# Altium project MMS Tester.PrjPcb
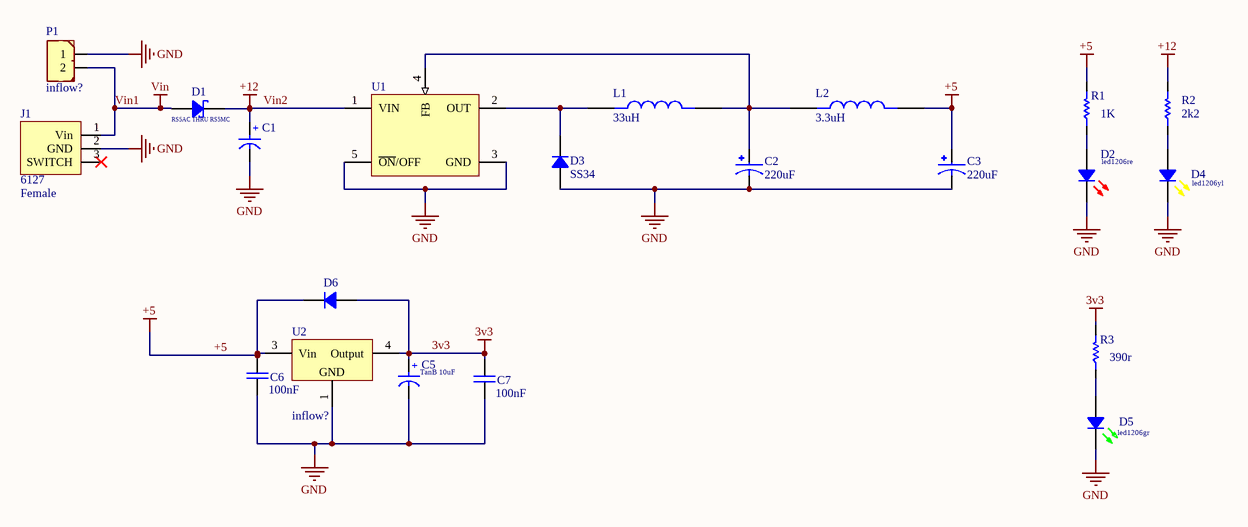
[diagram p0: voltage regulators.SchDoc]
By: A.SharifNia; Email: arsham.sharifnia@gmail.com
2 sheets, 60 parts. Net scope: flat (ports and power ports of the same name join across sheets).
Board file: FinalPCB.PcbDoc
Sheets:
  voltage regulators.SchDoc
  Transistors.SchDoc

## Sheet voltage regulators.SchDoc
size A; SheetNumber: 1; SheetTotal: 2

### Parts
C1  1000u'F, 25'V  [Cap electrolitic radial 10x20-5]  (value not drawn)
C2  220uF  [PCBComponent_1]
C3  220uF  [PCBComponent_1]
C5  TanB 10uF  [SMT_C_Tantalum_B]
C6  100nF  [CAP 1206/3216]
C7  100nF  [CAP 1206/3216]
D1  RS5AC THRU RS5MC  [DO-214AB(SMC)]
D2  led1206re  [LED 1206/3216 RED]
D3  SS34  [SS34]
D4  led1206yl  [LED 1206/3216 YELLOW]
D5  led1206gr  [LED 1206/3216 GREEN]
D6  1N4148  [LL4148]  (value not drawn)
J1  Inflow: 6127  [Power Jack BIG]  (hidden comment: Female)
L1  33uH  [Ind7.3x6.6]
L2  3.3uH  [IND5.3x5.3]
P1  Inflow: inflow?  [Phoenix_2PIN_RA_P5.08mm]  (hidden comment: 2'Pin)
R1  1K  [RES 1206 (3216X08L)]
R2  2k2  [RES 1206 (3216X08L)]
R3  390r  [RES 1206 (3216X08L)]
U1  lm2596-5vCTE  [D2PAK_TO-263-5]  (value not drawn)
U2  Inflow: inflow?  [TO252-3N]  (hidden comment: AMS1117CD)

### Nets
3v3: C5.1(+) C7.1 D6.1 R3.2 U2.4(Output)
+5: C3.1 C6.1 D6.2 L2.2 R1.2 U2.3(Vin)
GND: C1.2(-) C2.2 C3.2 C5.2(-) C6.2 C7.2 D2.2 D3.1 D4.2 D5.2 J1.2(GND) P1.1 U1.3(GND) U1.5(~{ON}/OFF) U2.1(GND)
Vin1: D1.1 J1.1(Vin) P1.2  [also labelled Vin]
Vin2: C1.1(+) D1.2 R2.2 U1.1(VIN)  [also labelled +12]
NetC2_1: C2.1 L1.2 L2.1 U1.4(FB)
NetD2_1: D2.1 R1.1
NetD3_2: D3.2 L1.1 U1.2(OUT)
NetD4_1: D4.1 R2.1
NetD5_1: D5.1 R3.1

Not connected (* = marked no-connect by the designer): J1 3(SWITCH)*

### Library data of the parts
C1 = Cap_Elec_1000u_25: Electrolit Capacitor; Inflow: 4225; Rating: Rating?; Type: Type?; Validation: NT; Value: 1000u'F, 25'V; Package: Package?
C2 C3 = Cap_SMD7x7
C5 = Cap_Tantalum: Tantalum Capacitor,TAJ Series-SMD; Inflow: inflow?; Validation: Valid; Rating: Rating?; Value: Value?; Package: Package?; Type: Tantalum
C6 C7 = Cap_Multi_22p_50_1206: Bipolar ceramic capacitor SMD; Value: 22p'F, 50'V; Rating: Rating?; Type: Type?; Validation: Valid; Inflow: 5240; Package: Package?
D1 = Semi_Diod_Sch_SK54: Surface Mount Fast Recovery Rectifiers / Reverse Voltage - 50 to 1000 V / Forward Current - 5 A; Type: Schottky; Rating: Rating?; Value: SK54; Validation: Valid; Inflow: 5230; Package: SMC
D2 = Semi_LED_Red_1206: LED; Inflow: 5253; Rating: Rating?; Type: Type?; Validation: Valid; Value: Red, 1206; Package: Package?
D3 = SS34: Schottky Rectifiers; Rating: Rating?; Value: SK54; Validation: Valid; Type: Schottky; Package: SMC; Arsham: SS34
D4 = Semi_LED_Yellow_1206: LED; Rating: Rating?; Type: Type?; Validation: Valid; Inflow: 5250; Value: Yellow, 1206; Package: Package?
D5 = Semi_LED_Green_1206: LED; Rating: Rating?; Type: Type?; Validation: Valid; Inflow: 5247; Value: Green, 1206; Package: Package?
D6 = Semi_Diod_STD_1N4148_MELF: High Conductance Fast Diode; Rating: Rating?; Type: Type?; Validation: NT; Inflow: 6205; Value: 1N4148; Package: Package?
J1 = Con_Power_Jack: Power Jack; Rating: Rating?; Validation: Valid; Type: Type?; Package: Package?; Value: Female
L1 = IND 7.3x7.3: Isat=2.5A / (ohm)max. 240 m-Ohm  @ 100kHz
L2 = IND 5.3x5.3: Isat=1.74A / (ohm)max. .0.037 @ 100kHz
P1 = Con_Power_2: Power Connector 2'Pin; Rating: Rating?; Validation: NT; Value: 2'Pin; Package: Package?; Type: Type?
R1 R3 = Res_SMD_1206: Resistor; Inflow: inflow?; Rating: 0.25W; Validation: Valid; Value: Value?; Package: 1206; Type: 10%
R2 = Res_SMD: Resistor; Inflow: inflow?; Rating: Rating?; Validation: Valid; Value: Value?; Package: Package?; Type: 10%
U1 = IC_Reg_LM2596: Simple switcher 3'A step-down voltage regulator; Value: Value?; Rating: S; Validation: Valid; Inflow: inflow?; Type: Switching; Package: TO-263
U2 = IC_Reg_AMS1117_CD: 800mA LOW DROPOUT VOLTAGE REGULATOR; Rating: Rating?; Validation: NT; Value: AMS1117CD; Package: Package?; Type: Type?

## Sheet Transistors.SchDoc
size A; SheetNumber: 2; SheetTotal: 2
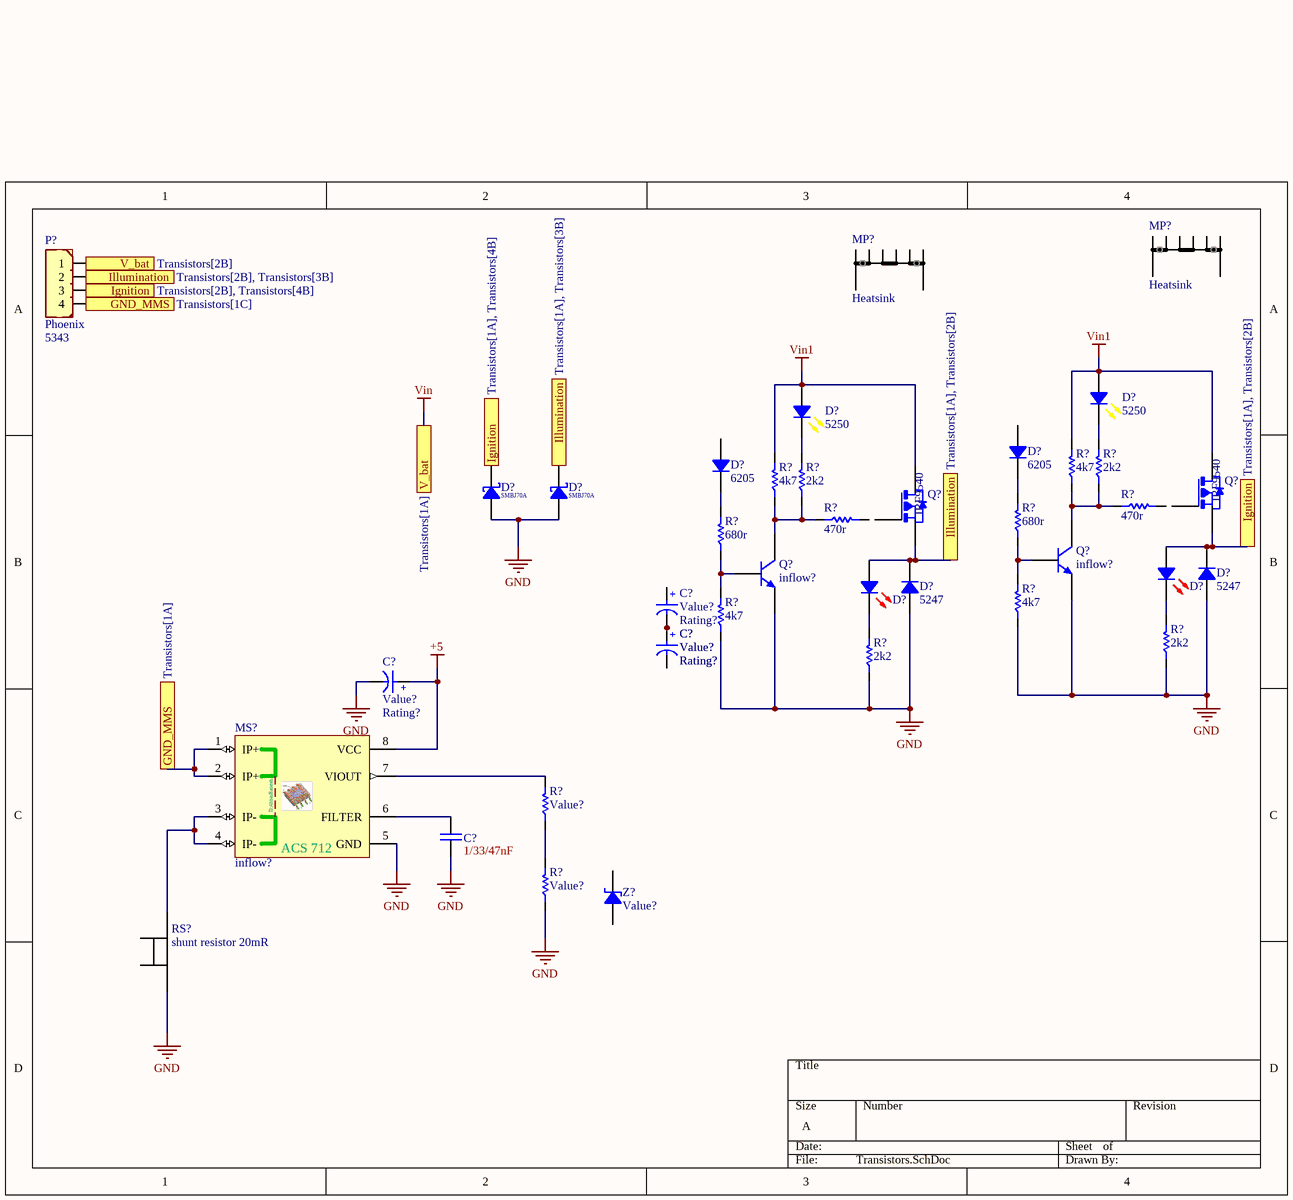
[diagram p1: Transistors.SchDoc]

### Parts
(Parts that share a designator on the sheet are numbered #1, #2 ... from top to bottom, then left to right.)
C?#1  Rating: Rating?  [SMT_C_Tantalum_A]  (hidden comment: Value?)
C?#2  Rating: Rating?  [SMT_C_Tantalum_A]  (hidden comment: Value?)
C?#3  Rating: Rating?  [SMT_C_Tantalum_A]  (hidden comment: Value?)
C?#4  Rating: Rating?  [SMT_C_Tantalum_A]  (hidden comment: Value?)
C?#5  1/33/47nF  [CAP 1206/3216]
D?#1  Inflow: 5250  [LED 1206/3216 YELLOW]  (hidden comment: Yellow, 1206)
D?#2  Inflow: 5250  [LED 1206/3216 YELLOW]  (hidden comment: Yellow, 1206)
D?#3  Inflow: 6205  [LL4148]  (hidden comment: 1N4148)
D?#4  Inflow: 6205  [LL4148]  (hidden comment: 1N4148)
D?#5  SMBJ70A  [DO214AA SMB]
D?#6  SMBJ70A  [DO214AA SMB]
D?#7  Red, 1206  [LED 1206/3216 RED]  (value not drawn)
D?#8  Red, 1206  [LED 1206/3216 RED]  (value not drawn)
D?#9  Inflow: 5247  [DO214AC SMA]  (hidden comment: 1N4007)
D?#10  Inflow: 5247  [DO214AC SMA]  (hidden comment: 1N4007)
MP?#1  Heatsink  [Heatsink]
MP?#2  Heatsink  [Heatsink]
MS?  Inflow: inflow?  [8S2_N]  (hidden comment: ACS712-5A)
P?  Inflow: 5343  [Phoenix_4PIN_RA_P5.08mm]  (hidden comment: Phoenix)
Q?#1  Inflow: IRF9540  [TO-220AB]  (hidden comment: IRF9Z24)
Q?#2  Inflow: IRF9540  [TO-220AB]  (hidden comment: IRF9Z24)
Q?#3  Inflow: inflow?  [SOT23_N]  (hidden comment: NPN)
Q?#4  Inflow: inflow?  [SOT23_N]  (hidden comment: NPN)
R?#1  4k7  [RES 1206 (3216X08L)]
R?#2  2k2  [RES 1206 (3216X08L)]
R?#3  4k7  [RES 1206 (3216X08L)]
R?#4  2k2  [RES 1206 (3216X08L)]
R?#5  470r  [RES 1206 (3216X08L)]
R?#6  470r  [RES 1206 (3216X08L)]
R?#7  680r  [RES 1206 (3216X08L)]
R?#8  680r  [RES 1206 (3216X08L)]
R?#9  4k7  [RES 1206 (3216X08L)]
R?#10  4k7  [RES 1206 (3216X08L)]
R?#11  2k2  [RES 1206 (3216X08L)]
R?#12  2k2  [RES 1206 (3216X08L)]
R?#13  Value?  [RES 1206 (3216X08L)]
R?#14  Value?  [RES 1206 (3216X08L)]
RS?  shunt resistor 20mR  [shunt resistor]
Z?  Value?  [SOD80, LL-34]

### Ports
GND_MMS (see Transistors[1A]), GND_MMS (see Transistors[1C]), Ignition (see Transistors[1A], Transistors[2B]), Ignition (see Transistors[1A], Transistors[4B]), Ignition (see Transistors[2B], Transistors[4B]), Illumination (see Transistors[1A], Transistors[2B]), Illumination (see Transistors[1A], Transistors[3B]), Illumination (see Transistors[2B], Transistors[3B]), V_bat (see Transistors[1A]), V_bat (see Transistors[2B])

### Nets
+5: C?#4.1(+) MS?.8(VCC)
GND: C?#4.2(-) C?#5.2 D?#5.1 D?#6.1 D?#9.1 D?#10.1 MS?.5(GND) Q?#3.2(E) Q?#4.2(E) R?#9.1 R?#10.1 R?#11.1 R?#12.1 R?#14.1 RS?.1
Vin: P?.1 ; port V_bat  [project net Vin1]
Vin1: D?#1.1 D?#2.1 Q?#1.3(S) Q?#2.3(S) R?#1.2 R?#3.2
NetC?#1_2: C?#1.2(-) C?#2.1(+) C?#3.1(+)
NetC?#2_2: C?#2.2(-) C?#3.2(-)
NetC?#5_1: C?#5.1 MS?.6(FILTER)
NetD?#1_2: D?#1.2 R?#2.2
NetD?#2_2: D?#2.2 R?#4.2
NetD?#3_2: D?#3.2 R?#7.2
NetD?#4_2: D?#4.2 R?#8.2
NetD?#5_2: D?#5.2 D?#7.1 D?#9.2 P?.3 Q?#1.2(D) ; port Ignition
NetD?#6_2: D?#6.2 D?#8.1 D?#10.2 P?.2 Q?#2.2(D) ; port Illumination
NetD?#7_2: D?#7.2 R?#11.2
NetD?#8_2: D?#8.2 R?#12.2
NetMS?_1: MS?.1(IP+) MS?.2(IP+) P?.4 ; port GND_MMS
NetMS?_3: MS?.3(IP-) MS?.4(IP-) RS?.2
NetMS?_7: MS?.7(VIOUT) R?#13.2
NetQ?#3_1: Q?#3.1(B) R?#7.1 R?#9.2
NetQ?#3_3: Q?#3.3(C) R?#1.1 R?#2.1 R?#5.1
NetQ?#4_1: Q?#4.1(B) R?#8.1 R?#10.2
NetQ?#4_3: Q?#4.3(C) R?#3.1 R?#4.1 R?#6.1
NetR?#13_1: R?#13.1 R?#14.2

Not connected (* = marked no-connect by the designer): C?#1 1(+); D?#3 1; D?#4 1; MP?#1 1 2; MP?#2 1 2; Q?#1 1(G); Q?#2 1(G); R?#5 2; R?#6 2; Z? 1 2

### Notes on the sheet
- (in symbol ModSen_ACS712ELCTR) D:AbbasBasereh; ACS 712

### Library data of the parts
C?#1-C?#4 = Cap_Tantalum: Tantalum Capacitor,TAJ Series-SMD; Inflow: inflow?; Validation: Valid; Package: Package?; Type: Tantalum; Value: Value?
C?#5 = Cap_Multi_SMD_100nF_1206: Bipolar ceramic capacitor SMD; Type: MultiLayer; Inflow: inflow?; Rating: 50V; Validation: Valid; Value: 100n; Package: 1206
D?#1 D?#2 = Semi_LED_Yellow_1206: LED; Rating: Rating?; Type: Type?; Validation: Valid; Value: Yellow, 1206; Package: Package?
D?#3 D?#4 = Semi_Diod_STD_1N4148_MELF: High Conductance Fast Diode; Rating: Rating?; Type: Type?; Validation: NT; Value: 1N4148; Package: Package?
D?#5 D?#6 = Semi_Diod_TVS_SMBJ15A: Transil diodes provide high overvoltage protection by clamping action; Rating: 15V; Type: TVS; Validation: Valid; Inflow: inflow?; Value: SMBJ15A; Package: SMB
D?#7 D?#8 = Semi_LED_Red_1206: as D2 on sheet voltage regulators; Value: Red, 1206; Package: Package?
D?#9 D?#10 = Semi_Diod_STD_1N4007_SMD: General purpose rectifiers; Rating: Rating?; Type: Type?; Validation: Valid; Value: 1N4007; Package: Package?
MS? = ModSen_ACS712ELCTR: Fully Integrated, Hall Effect-Based Linear Current Sensor IC  with 2.1 kVRMS Isolation and a Low-Resistance Current Conductor; Rating: Rating?; Validation: NT; Value: ACS712-5A; Package: Package?; Type: Type?
P? = Con_Power_4_Ph_R: Phoenix Power Connector 4'Pin; Rating: 4b; Validation: Valid; Package: Dip; Type: Right; Value: Phoenix
Q?#1 Q?#2 = IRF9Z24: P-Channel MOSFET; Rating: Rating?; Type: Type?; Validation: NT; Value: P-Channel; Package: Package?
Q?#3 Q?#4 = Semi_BJT_BC817: NPN General purpose Transistor; Rating: Rating?; Type: Type?; Validation: Valid; Value: NPN; Package: Package?
R?#1-R?#12 = Res_SMD: as R2 on sheet voltage regulators; Package: Package?; Type: 10%
R?#13 R?#14 = Res_SMD: Resistor; Inflow: inflow?; Rating: Rating?; Validation: Valid; Package: Package?; Type: 10%; Value: Value?
RS? = shunt resistor
Z? = Semi_Diod_Zener_SMD: Zener Diode; Rating: Rating?; Inflow: inflow?; Validation: Valid; Type: Zener; Package: SOD-80; Value: Value?

## Nets that join several sheets
+5: voltage regulators (6 pins), Transistors (C?#4.1 MS?.8)
GND: voltage regulators (15 pins), Transistors (15 pins)
Vin1: voltage regulators (D1.1 J1.1 P1.2), Transistors (P?.1)